# EasyEDA Pro project ProProject_诚君STC8H_2024-07-14.epro

# Schematic STC8H8K64U核心板
Create Date: 2024-06-16; Page Name: P1; Project Name: 诚君STC8H; Schematic Name: STC8H8K64U核心板; Update Date: 2024-07-07; Company: 诚君工作室; Drawed: HonestLiu; Page Size: A4; Reviewed: HonestLiu; Version: V1.2
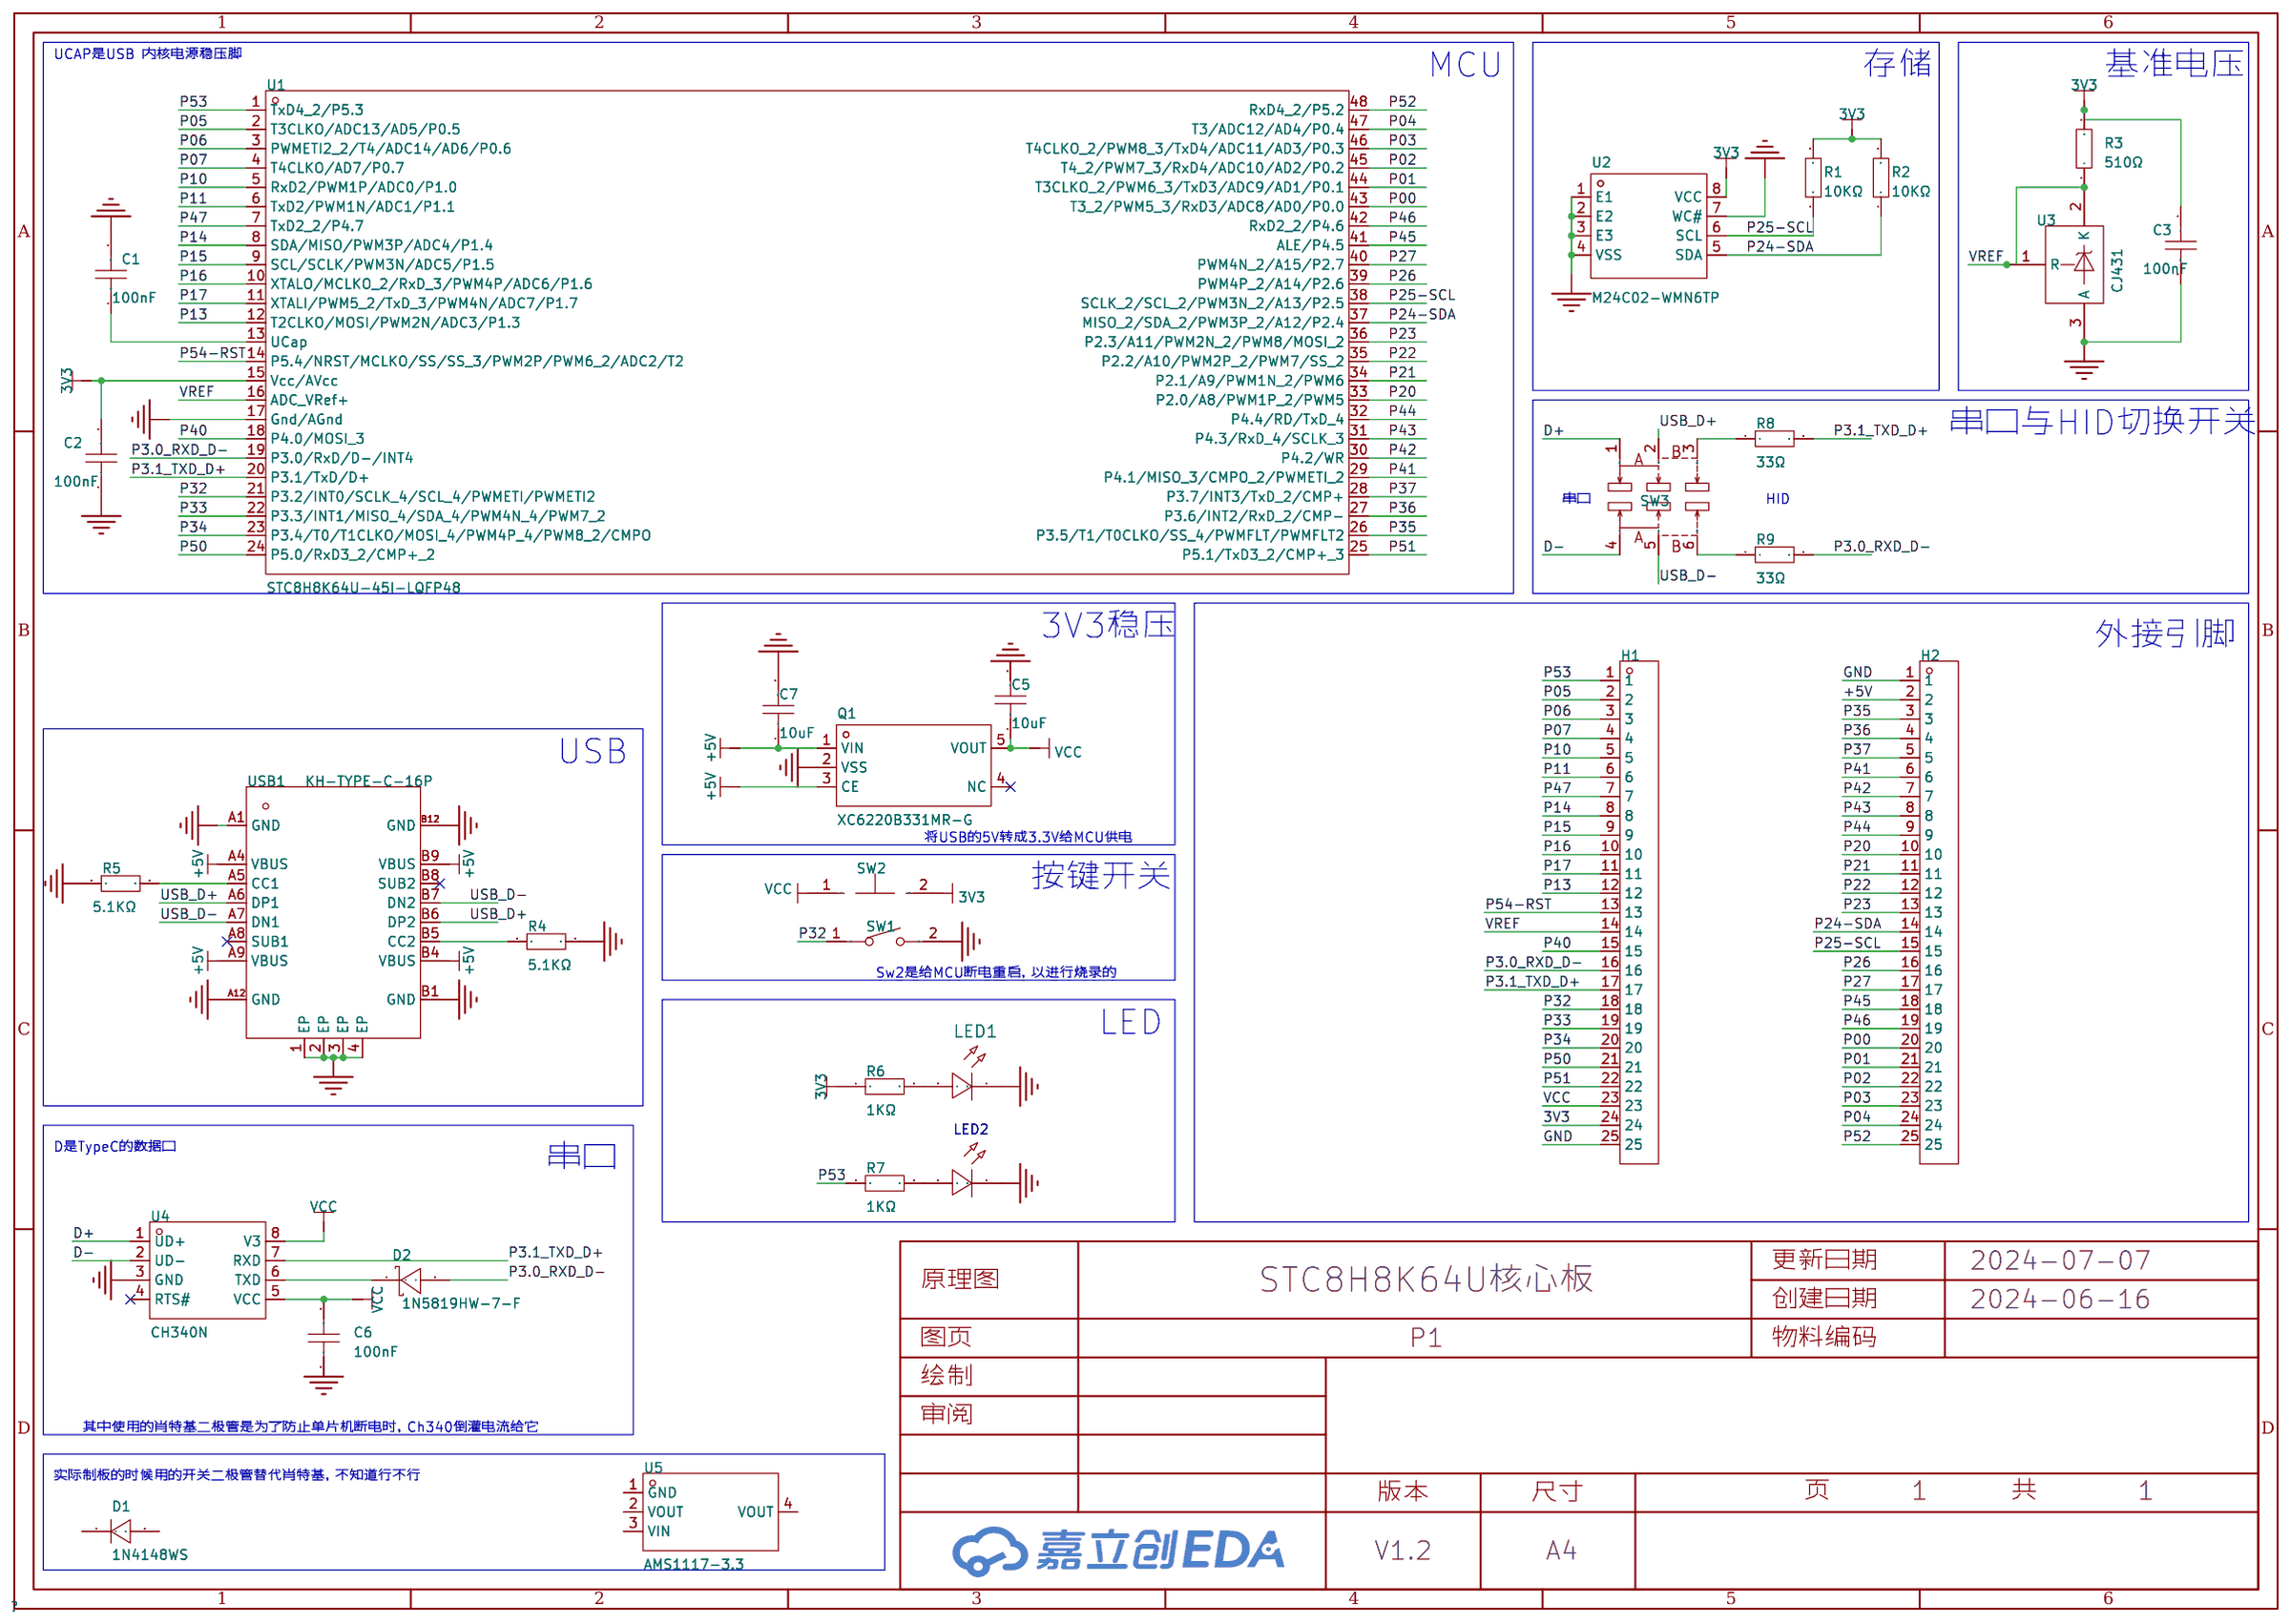
[diagram p0: schematic sheet]

## Parts
C1  100nF  [C0805]
C2  100nF  [C0805]
C3  100nF  [C0805]
C5  10uF  [C0805]
C6  100nF  [C0805]
C7  10uF  [C0805]
D1  1N4148WS  [SOD-323_L1.8-W1.3-LS2.5-RD]
D2  1N5819HW-7-F  [SOD-123_L2.7-W1.6-LS3.7-RD]
H1  X6511WV-25H-C60D30  [HDR-TH_25P-P2.54-V-M]
H2  X6511WV-25H-C60D30  [HDR-TH_25P-P2.54-V-M]
LED1  -  [LED_0805]
LED2  -  [LED_0805]
Q1  XC6220B331MR-G  [SOT-25_L3.0-W1.6-P0.95-LS2.8-TL]
R1  10KΩ  [R0805]
R2  10KΩ  [R0805]
R3  510Ω  [R0805]
R4  5.1KΩ  [R0805]
R5  5.1KΩ  [R0805]
R6  1KΩ  [R0805]
R7  1KΩ  [R0805]
R8  33Ω  [R0805]
R9  33Ω  [R0805]
SW1  TS-1088-AR02016  [SW-SMD_L3.9-W3.0-P4.45]
SW2  TS-1089A-B3D4  [KEY-SMD_2P-L6.0-W3.8-LS7.30-L]
SW3  MST22D18G2 125  [SW-SMD_MST22D18G2]
U1  STC8H8K64U-45I-LQFP48  [LQFP-48_L7.0-W7.0-P0.50-LS9.0-BL]
U2  M24C02-WMN6TP  [SOIC-8_L4.9-W3.9-P1.27-LS6.0-BL]
U3  CJ431  [SOT-23-3_L2.9-W1.6-P1.90-LS2.8-BR]
U4  CH340N  [SOP-8_L4.9-W3.9-P1.27-LS6.0-BL]
U5  AMS1117-3.3  [SOT-223-3_L6.5-W3.4-P2.30-LS7.0-BR]
USB1  KH-TYPE-C-16P  [USB-C-SMD_KH-TYPE-C-16P]

## Library data of the parts
C1-C3 C5-C7 = CAP_0805: Supplier Footprint: 0805
D1 = 1N4148WS_C2128: 二极管配置:独立式;正向压降(Vf):1.25V@150mA;直流反向耐压(Vr):100V;平均整流电流(Io):150mA;功率:200mW;反向恢复时间(trr):4ns;; LCSC Part Name: 电压:100V 电流:150mA; Supplier Part: C2128; Manufacturer: CJ(江苏长电/长晶); Supplier Footprint: SOD-323; JLCPCB Part Class: 基础库; Datasheet: https://atta.szlcsc.com/upload/public/pdf/source/20140809/1457707208178.pdf; Supplier: LCSC; Diode Configuration: 独立式; Forward Voltage (Vf@If): 1.25V@150mA; Reverse Voltage (Vr): 100V; Average Rectified Current (Io): 150mA; Power Dissipation: 200mW; Reverse Leakage Current: 1uA@75V; Reverse Recovery Time (trr): 4ns
D2 = 1N5819HW-7-F: 正向压降(Vf):450mV@1A;直流反向耐压(Vr):40V;平均整流电流(Io):1A;; LCSC Part Name: 电压:40V 电流:1A; Supplier Part: C82544; Manufacturer: DIODES(美台); Supplier Footprint: SOD-123; JLCPCB Part Class: 扩展库; Datasheet: https://atta.szlcsc.com/upload/public/pdf/source/20161024/1477288459223.pdf; Supplier: LCSC; Forward Voltage (Vf@If): 450mV@1A; Reverse Voltage (Vr): 40V; Average Rectified Current (Io): 1A; Reverse Leakage Current (Ir): 1mA@40V
H1 H2 = X6511WV-25H-C60D30: 插针结构:1x25P;间距:2.54mm;行距:2.54mm;圆针/方针:方针;安装类型:-;排数:单排;总PIN位数:25P;额定电流:3A;额定电压:250V;配合针长度:6mm;塑高:2.5mm;端接针长度:3mm;触头材质:黄铜;触头镀层:金;工作温度范围:-40℃~+105℃;焊接温度(最大值):260℃;颜色:黑色;; LCSC Part Name: 1x25P 间距:2.54mm 方针; Supplier Part: C725957; Manufacturer: XKB Connection(中国星坤); Supplier Footprint: 插件,P=2.54mm; JLCPCB Part Class: 扩展库; Supplier: LCSC; Pin Structure: 1x25P; Pitch: 2.54mm; Row Spacing: 2.54mm; Circluar Pins/Square Pins: 方针; Number of Rows: 单排; Number of Pins: 25P; Current Rating (Max): 3A; Voltage Rating (Max): 250V; Length of Mating Pin: 6mm; Insulation Height: 2.5mm; Length of End Connection Pin: 3mm; Contact Material: 黄铜; Contact Plating: 金; Operating Temperature Range: -40℃~+105℃; Soldering Temperature(Max): 260℃; Color: 黑色
LED1 = LED_0805-R: Supplier Footprint: 0805
LED2 = LED_0805-B: Supplier Footprint: 0805
Q1 = XC6220B331MR-G: 输出类型:固定;最大输入电压:6V;输出电压:3.3V;最大输出电流:1A;电源纹波抑制比(PSRR):50dB@(1kHz);输出极性:正极;; LCSC Part Name: 输入6V 输出3.3V 1A; Supplier Part: C86534; Manufacturer: TOREX(特瑞仕); Supplier Footprint: SOT-25-5; JLCPCB Part Class: 扩展库; Datasheet: https://atta.szlcsc.com/upload/public/pdf/source/20161119/1479540186106.pdf; Supplier: LCSC; Output Type: 固定; Maximum Input Voltage: 6V; Output Voltage: 3.3V; MAX Output Current: 1A; Power Supply Rejection Ratio (PSRR): 50dB@(1kHz); Dropout Voltage: 655mV@(1A); standby current: 18uA; Operating Temperature: -40℃~+85℃; Output Polarity: 正极; Number of Outputs: 1
R1-R9 = Res_0805: Supplier Footprint: 0805
SW1 = TS-1088-AR02016: 电路结构:单刀单掷;按钮形状:圆形按钮;作用力:160gf;安装方式:立贴;开关长度:4mm;开关宽度:3mm;开关高度:2mm;带支架:不带;触点电流:50mA;额定电压(DC):12V;绝缘电阻:100MΩ;机械寿命:10万次;; LCSC Part Name: 4*3*2mm 立贴 轻触开关; Supplier Part: C720477; Manufacturer: XUNPU(讯普); Supplier Footprint: SMD; JLCPCB Part Class: 扩展库; Datasheet: https://atta.szlcsc.com/upload/public/pdf/source/20200810/C720475_60D09DD6C54279ADDB2DC25100F1CC11.pdf; Supplier: LCSC; Circuit: 单刀单掷; Actuator Style: 圆形按钮; Operating Force: 160gf; Mounting Style: 立贴; Switch Length: 4mm; Switch Width: 3mm; Switch Height: 2mm; Strike Gundam: 不带; Contact Current: 50mA; Voltage Rating (DC): 12V; Insulation Resistance: 100MΩ; Actuator/Cap Color: 黑色; Pin Style: SMD接片; Mechanical Life: 10万次; Operating Temperature: -30℃~+80℃
SW2 = TS-1089A-B3D4: 电路结构:单刀单掷;按钮形状:圆形按钮;安装方式:-;开关长度:6mm;开关宽度:3.65mm;开关高度:2.6mm;带灯:-;机械寿命:-;; LCSC Part Name: 轻触开关6.0*3.65*2.6常闭式硅胶圆蓝柄250gf; Supplier Part: C498305; Manufacturer: Yuandi(元迪); Supplier Footprint: SMD,3.7x6mm; JLCPCB Part Class: 扩展库; Datasheet: https://atta.szlcsc.com/upload/public/pdf/source/20200318/C498305_E1D5433E42700991680A097C7C5FB391.pdf; Supplier: LCSC; Circuit: 单刀单掷; Actuator Style: 圆形按钮; Switch Length: 6mm; Switch Width: 3.65mm; Switch Height: 2.6mm
SW3 = MST22D18G2 125: 电路结构:双刀双掷;安装方式:立贴;开关颜色:黑色;额定电流(DC):100mA;额定电压(DC):12V;机械寿命:1万次;; LCSC Part Name: 拨动开关/两档立式 6脚贴片 柄长2.0mm 大六立贴 9.1*3.5mm; Supplier Part: C2906280; Manufacturer: SHOU HAN(首韩); Supplier Footprint: SMD; JLCPCB Part Class: 扩展库; Datasheet: https://atta.szlcsc.com/upload/public/pdf/source/20211019/449AD4EDF23AADA7A5C4E3C063EDBB30.pdf; Supplier: LCSC; Circuit: 双刀双掷; Pin Style: 鸥翼型; Mounting Style: 立贴; Actuator Color: 黑色; Current Rating (DC): 100mA; Voltage Rating (DC): 12V; Mechanical Life: 1万次; Operating Temperature: -25℃~+70℃
U1 = STC8H8K64U-45I-LQFP48: CPU内核:51系列;程序存储容量:64KB;GPIO端口数量:-;工作电压范围:-;CPU最大主频:-;程序存储器类型:FLASH;; LCSC Part Name: 宽电压/高速/高可靠/低功耗/强抗静电/较强抗干扰的新一代 8051 单片机; Supplier Part: C3013145; Manufacturer: STC(宏晶); Supplier Footprint: LQFP-48(7x7); JLCPCB Part Class: 扩展库; Datasheet: https://atta.szlcsc.com/upload/public/pdf/source/20230914/FE7F6A67FEB4E2D9A560A799C5B97078.pdf; Supplier: LCSC; CPU Core: 51系列; Program Storage Size: 64KB; Program Memory Type: FLASH
U2 = M24C02-WMN6TP: 接口类型:I2C;存储容量:2Kbit;; Supplier Part: C7562; Manufacturer: ST(意法半导体); Supplier Footprint: SOIC-8; JLCPCB Part Class: 扩展库; Datasheet: https://atta.szlcsc.com/upload/public/pdf/source/20140724/1457707167301.pdf; Supplier: LCSC; Interface Type: I2C; Memory Size: 2Kbit; Supply Voltage: 2.5V~5.5V; Operating Temperature: -40℃~+85℃
U3 = CJ431_C3113: 输出类型:可调;输出电压:2.5V~36V;输出电流:100mA;精度:±0.5%;; Supplier Part: C3113; Manufacturer: CJ(江苏长电/长晶); Supplier Footprint: SOT-23; JLCPCB Part Class: 基础库; Datasheet: https://atta.szlcsc.com/upload/public/pdf/source/20180130/C154948_15172973254591323355.pdf; Supplier: LCSC; Output Type: 可调; Output Voltage: 2.5V~36V; Output Current: 100mA; Tolerance: ±0.5%; Temperature Coefficient: 50ppm/℃; Minimum Cathode Current for Regulation: 1mA; Operating Temperature: -25℃~+85℃@(TA)
U4 = CH340N: LCSC Part Name: USB转串口芯片 CH340; Supplier Part: C2977777; Manufacturer: WCH(南京沁恒); Supplier Footprint: SOP-8; JLCPCB Part Class: 扩展库; Datasheet: https://atta.szlcsc.com/upload/public/pdf/source/20230530/6E401E9554E9F5311886CC8B3F89B62E.pdf; Supplier: LCSC
U5 = AMS1117-3.3_C6186: 输出类型:固定;最大输入电压:-;输出电压:3.3V;最大输出电流:1A;电源纹波抑制比(PSRR):72dB@(120Hz);输出极性:正极;; LCSC Part Name: 输出3.3V 1A; Supplier Part: C6186; Manufacturer: AMS; Supplier Footprint: SOT-223; JLCPCB Part Class: 基础库; Datasheet: https://atta.szlcsc.com/upload/public/pdf/source/20180727/C6186_7A095716F0823C02F1997A905E26C086.pdf; Supplier: LCSC; Output Type: 固定; Output Voltage: 3.3V; MAX Output Current: 1A; Power Supply Rejection Ratio (PSRR): 72dB@(120Hz); Dropout Voltage: 1.3V@(800mA); Output Polarity: 正极; Number of Outputs: 1
USB1 = KH-TYPE-C-16P: 连接器类型:Type-C;标准:-;公母:母;端口数量:1;触点数量:16P;安装方式:卧贴;额定电流 - 电源:3A;工作温度范围:-40℃~+85℃;; LCSC Part Name: Type-C 母 卧贴; Supplier Part: C709357; Manufacturer: kinghelm(金航标); Supplier Footprint: SMD; JLCPCB Part Class: 扩展库; Datasheet: https://atta.szlcsc.com/upload/public/pdf/source/20200911/C709357_AA8DCEB38BB20E3035A7ED7AE7667837.pdf; Supplier: LCSC; Connector Type: Type-C; Gender: 母; Number of Ports: 1; Number of Contacts: 16P; Mounting Style: 卧贴; Current Rating - Power (Max): 3A; Operating Temperature Range: -40℃~+85℃

## Nets
3V3: C2.2 C3.1 H1.24 R1.2 R2.2 R3.2 R6.1 SW2.2 U1.15(Vcc/AVcc) U2.8(VCC)
+5V: C7.1 H2.2 Q1.1(VIN) Q1.3(CE) USB1.A4(VBUS) USB1.A9(VBUS) USB1.B4(VBUS) USB1.B9(VBUS)
GND: C1.2 C2.1 C3.2 C5.2 C6.1 C7.2 H1.25 H2.1 LED1.1(C) LED2.1(C) Q1.2(VSS) R4.2 R5.1 SW1.2 U1.17(Gnd/AGnd) U2.1(E1) U2.2(E2) U2.3(E3) U2.4(VSS) U2.7(WC#) U3.3(A) U4.3(GND) USB1.1(EP) USB1.2(EP) USB1.3(EP) USB1.4(EP) USB1.A1(GND) USB1.A12(GND) USB1.B1(GND) USB1.B12(GND)
VCC: C5.1 C6.2 H1.23 Q1.5(VOUT) SW2.1 U4.5(VCC) U4.8(V3)
D+: SW3.1 U4.1(UD+)
D-: SW3.4 U4.2(UD-)
P00: H2.20 U1.43(T3_2/PWM5_3/RxD3/ADC8/AD0/P0.0)
P01: H2.21 U1.44(T3CLKO_2/PWM6_3/TxD3/ADC9/AD1/P0.1)
P02: H2.22 U1.45(T4_2/PWM7_3/RxD4/ADC10/AD2/P0.2)
P03: H2.23 U1.46(T4CLKO_2/PWM8_3/TxD4/ADC11/AD3/P0.3)
P3.0_RXD_D-: D2.2(A) H1.16 R9.2 U1.19(P3.0/RxD/D-/INT4)
P3.1_TXD_D+: H1.17 R8.2 U1.20(P3.1/TxD/D+) U4.7(RXD)
P04: H2.24 U1.47(T3/ADC12/AD4/P0.4)
P05: H1.2 U1.2(T3CLKO/ADC13/AD5/P0.5)
P06: H1.3 U1.3(PWMETI2_2/T4/ADC14/AD6/P0.6)
P07: H1.4 U1.4(T4CLKO/AD7/P0.7)
P10: H1.5 U1.5(RxD2/PWM1P/ADC0/P1.0)
P11: H1.6 U1.6(TxD2/PWM1N/ADC1/P1.1)
P13: H1.12 U1.12(T2CLKO/MOSI/PWM2N/ADC3/P1.3)
P14: H1.8 U1.8(SDA/MISO/PWM3P/ADC4/P1.4)
P15: H1.9 U1.9(SCL/SCLK/PWM3N/ADC5/P1.5)
P16: H1.10 U1.10(XTALO/MCLKO_2/RxD_3/PWM4P/ADC6/P1.6)
P17: H1.11 U1.11(XTALI/PWM5_2/TxD_3/PWM4N/ADC7/P1.7)
P20: H2.10 U1.33(P2.0/A8/PWM1P_2/PWM5)
P21: H2.11 U1.34(P2.1/A9/PWM1N_2/PWM6)
P22: H2.12 U1.35(P2.2/A10/PWM2P_2/PWM7/SS_2)
P23: H2.13 U1.36(P2.3/A11/PWM2N_2/PWM8/MOSI_2)
P24-SDA: H2.14 R2.1 U1.37(MISO_2/SDA_2/PWM3P_2/A12/P2.4) U2.5(SDA)
P25-SCL: H2.15 R1.1 U1.38(SCLK_2/SCL_2/PWM3N_2/A13/P2.5) U2.6(SCL)
P26: H2.16 U1.39(PWM4P_2/A14/P2.6)
P27: H2.17 U1.40(PWM4N_2/A15/P2.7)
P32: H1.18 SW1.1 U1.21(P3.2/INT0/SCLK_4/SCL_4/PWMETI/PWMETI2)
P33: H1.19 U1.22(P3.3/INT1/MISO_4/SDA_4/PWM4N_4/PWM7_2)
P34: H1.20 U1.23(P3.4/T0/T1CLKO/MOSI_4/PWM4P_4/PWM8_2/CMPO)
P35: H2.3 U1.26(P3.5/T1/T0CLKO/SS_4/PWMFLT/PWMFLT2)
P36: H2.4 U1.27(P3.6/INT2/RxD_2/CMP-)
P37: H2.5 U1.28(P3.7/INT3/TxD_2/CMP+)
P40: H1.15 U1.18(P4.0/MOSI_3)
P41: H2.6 U1.29(P4.1/MISO_3/CMPO_2/PWMETI_2)
P42: H2.7 U1.30(P4.2/WR)
P43: H2.8 U1.31(P4.3/RxD_4/SCLK_3)
P44: H2.9 U1.32(P4.4/RD/TxD_4)
P45: H2.18 U1.41(ALE/P4.5)
P46: H2.19 U1.42(RxD2_2/P4.6)
P47: H1.7 U1.7(TxD2_2/P4.7)
P50: H1.21 U1.24(P5.0/RxD3_2/CMP+_2)
P51: H1.22 U1.25(P5.1/TxD3_2/CMP+_3)
P52: H2.25 U1.48(RxD4_2/P5.2)
P53: H1.1 R7.1 U1.1(TxD4_2/P5.3)
P54-RST: H1.13 U1.14(P5.4/NRST/MCLKO/SS/SS_3/PWM2P/PWM6_2/ADC2/T2)
USB_D+: SW3.2 USB1.A6(DP1) USB1.B6(DP2)
USB_D-: SW3.5 USB1.A7(DN1) USB1.B7(DN2)
VREF: H1.14 R3.1 U1.16(ADC_VRef+) U3.1(R) U3.2(K)
$1N661: C1.1 U1.13(UCap)
$1N2230: R4.1 USB1.B5(CC2)
$1N2337: R5.2 USB1.A5(CC1)
$1N3155: D2.1(K) U4.6(TXD)
$1N4416: R8.1 SW3.3
$1N4419: R9.1 SW3.6
Net-(LED1-2): LED1.2(A) R6.2
Net-(LED2-2): LED2.2(A) R7.2

Not connected (* = marked no-connect by the designer): D1 1(K) 2(A); Q1 4(NC)*; U4 4(RTS#)*; U5 1(GND) 2(VOUT) 3(VIN) 4(VOUT); USB1 A8(SUB1)* B8(SUB2)*

## Notes on the sheet
- UCAP是USB 内核电源稳压脚
- MCU
- 存储
- 基准电压
- 串口与HID切换开关
- 串口
- HID
- 3V3稳压
- 外接引脚
- USB
- 将USB的5V转成3.3V给MCU供电
- 按键开关
- Sw2是给MCU断电重启，以进行烧录的
- LED
- D是TypeC的数据口
- 串口
- 其中使用的肖特基二极管是为了防止单片机断电时，Ch340倒灌电流给它
- 实际制板的时候用的开关二极管替代肖特基，不知道行不行

# Board PCB1
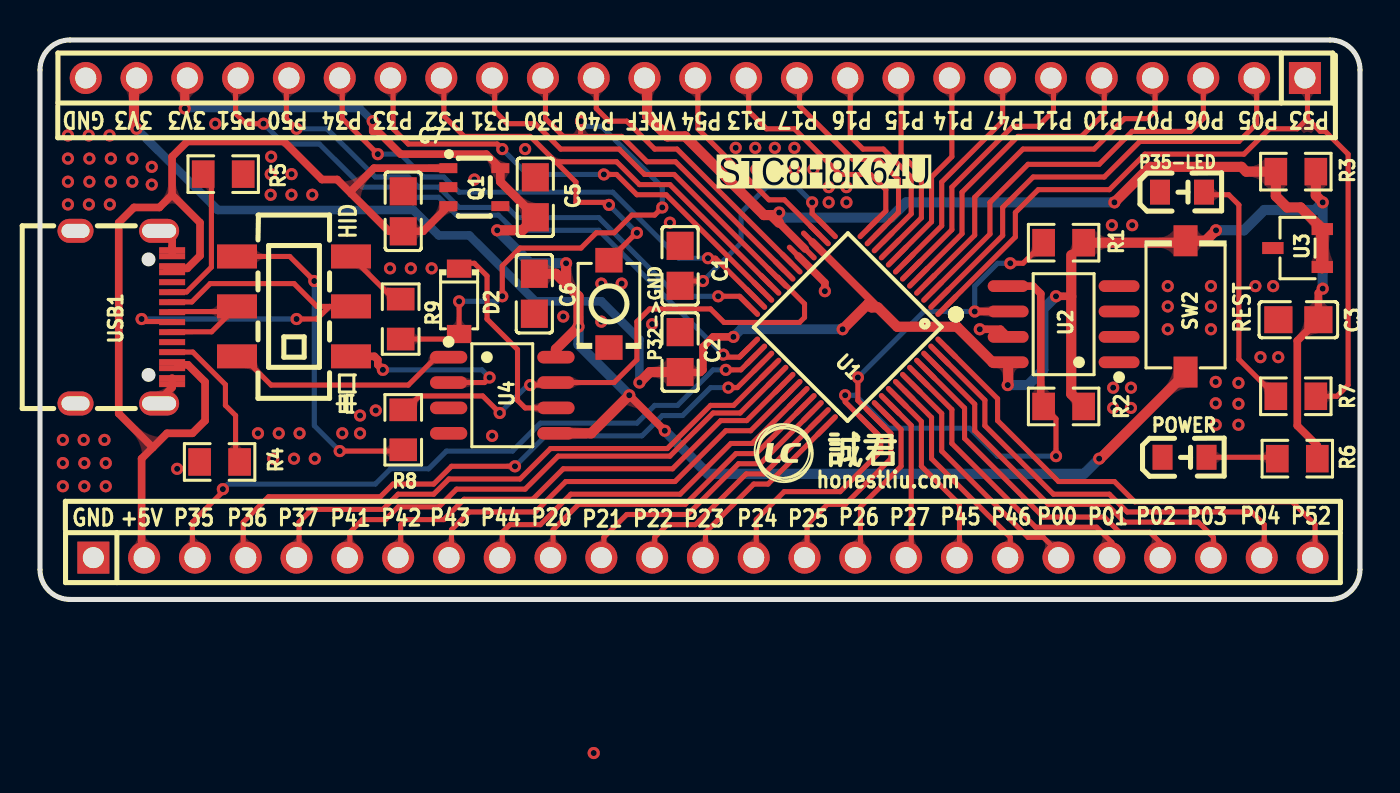
[diagram p1: board, top side]
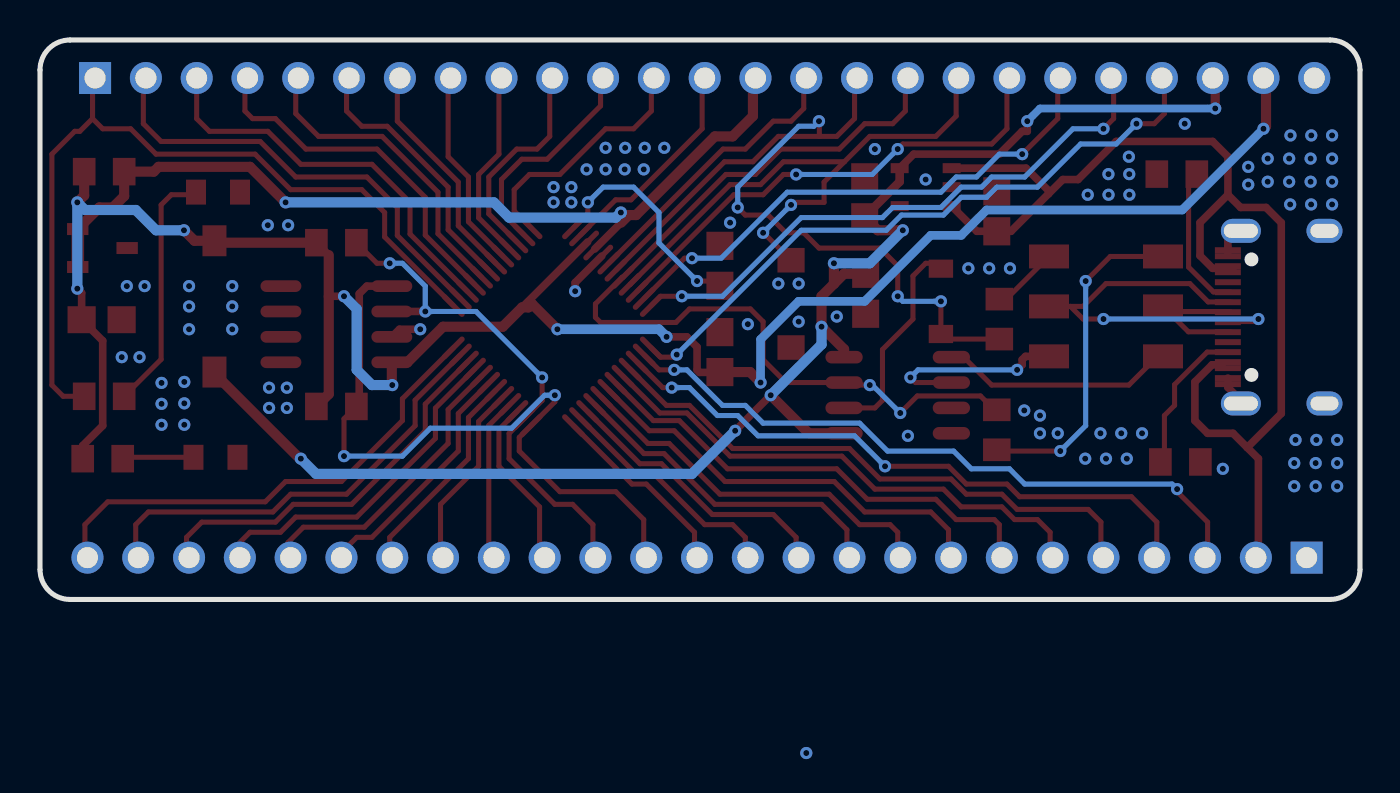
[diagram p2: board, bottom side, seen from below]

Outline 66 x 28 mm; copper layers: Top Layer, Bottom Layer. Coordinates in mm from the lower left corner of the outline.
Outline path: 0,26.5 0,1.5 arc(0.44,0.44) 1.5,0 64.5,0 arc(65.56,0.44) 66,1.5 66,26.5 arc(65.56,27.56) 64.5,28 1.5,28 arc(0.44,27.56) 0,26.5
Stack: Top Layer 0.035mm / Dielectric1 1.51mm FR4 er 4.5 / Bottom Layer 0.035mm

## Design rules (mm)
template: JLCPCB Capability(Two Layers Board)
spacing copperThickness1oz (default): track to track 0.102, other pairs 0.152 to 0.3
spacing copperThickness2oz: track to track 0.203, other pairs 0.152 to 0.3
track width copperThickness1oz (default): min 0.127, default 0.254, max 2.54
track width copperThickness2oz: min 0.203, default 0.254, max 2.54
differential pair differentialPair (default): width min 0.127, default 0.254, max 2.54; gap min 0.152, default 0.152
via viaSize (default): diameter min 0.5, default 0.61, max 10; hole min 0.3, default 0.305, max 6.3

## Placement (name value [footprint] x y rotation side)
C1  100nF  [C0805]  32 16.7 90 top
C2  100nF  [C0805]  32 12.38 270 top
C3  100nF  [C0805]  62.92 14 180 top
C5  10uF  [C0805]  24.77 20.13 90 top
C6  100nF  [C0805]  24.72 15.3 90 top
C7  10uF  [C0805]  18.16 19.42 90 top
D2  1N5819HW-7-F  [SOD-123_L2.7-W1.6-LS3.7-RD]  20.95 14.92 270 top
H1  X6511WV-25H-C60D30  [HDR-TH_25P-P2.54-V-M]  32.77 26.09 180 top
H2  X6511WV-25H-C60D30  [HDR-TH_25P-P2.54-V-M]  33.15 2.09 0 top
P32->GND  TS-1088-AR02016  [SW-SMD_L3.9-W3.0-P4.45]  28.45 14.79 270 top
P35-LED  -  [LED_0805]  57.15 20.38 0 top
POWER  -  [LED_0805]  57.28 7.11 0 top
Q1  XC6220B331MR-G  [SOT-25_L3.0-W1.6-P0.95-LS2.8-TL]  21.72 20.63 0 top
R1  10KΩ  [R0805]  51.18 17.85 0 top
R2  10KΩ  [R0805]  51.18 9.66 0 top
R3  510Ω  [R0805]  62.79 21.41 0 top
R4  5.1KΩ  [R0805]  8.98 6.88 180 top
R5  5.1KΩ  [R0805]  9.16 21.28 180 top
R6  1KΩ  [R0805]  62.86 7.05 180 top
R7  1KΩ  [R0805]  62.79 10.17 180 top
R8  33Ω  [R0805]  18.16 8.49 90 top
R9  33Ω  [R0805]  18.03 14.03 270 top
SW2  TS-1089A-B3D4  [KEY-SMD_2P-L6.0-W3.8-LS7.30-L]  57.28 14.66 270 top
SW3  MST22D18G2 125  [SW-SMD_MST22D18G2]  12.7 14.66 90 top
U1  STC8H8K64U-45I-LQFP48  [LQFP-48_L7.0-W7.0-P0.50-LS9.0-BL]  40.39 13.65 135 top
U2  M24C02-WMN6TP  [SOIC-8_L4.9-W3.9-P1.27-LS6.0-BL]  51.18 13.78 90 top
U3  CJ431  [SOT-23-3_L2.9-W1.6-P1.90-LS2.8-BR]  62.88 17.59 0 top
U4  CH340N  [SOP-8_L4.9-W3.9-P1.27-LS6.0-BL]  23.11 10.22 270 top
USB1  KH-TYPE-C-16P  [USB-C-SMD_KH-TYPE-C-16P]  4.19 14.13 270 top

## Footprints (pads in the part's own frame, mm; a bottom-side part is the same pattern mirrored in y, then rotated)
C0805
  rect 1.41x1.35 smd: 1(-1,0) 2(1,0)
HDR-TH_25P-P2.54-V-M
  rect 1.6x1.6 hole 1.05: 1(-30.48,0)
  round 1.6 hole 1.05: 2(-27.94,0) 3(-25.4,0) 4(-22.86,0) 5(-20.32,0) 6(-17.78,0) 7(-15.24,0) 8(-12.7,0) 9(-10.16,0) 10(-7.62,0) 11(-5.08,0) 12(-2.54,0) 13(0,0) 14(2.54,0) 15(5.08,0) 16(7.62,0) 17(10.16,0) 18(12.7,0) 19(15.24,0) 20(17.78,0) 21(20.32,0) 22(22.86,0) 23(25.4,0) 24(27.94,0) 25(30.48,0)
KEY-SMD_2P-L6.0-W3.8-LS7.30-L
  rect 1.55x1.2 smd: 1(3.285,0) 2(-3.285,0)
LED_0805
  rect 1x1.25 smd: 1(-1.15,0.005) 2(1.05,0.005)
LQFP-48_L7.0-W7.0-P0.50-LS9.0-BL
  oval 0.27x1.5 smd: 1(-2.75,-4.25) 2(-2.25,-4.25) 3(-1.75,-4.25) 4(-1.25,-4.25) 5(-0.75,-4.25) 6(-0.25,-4.25) 7(0.25,-4.25) 8(0.75,-4.25) 9(1.25,-4.25) 10(1.75,-4.25) 11(2.25,-4.25) 12(2.75,-4.25) 25(2.75,4.25) 26(2.25,4.25) 27(1.75,4.25) 28(1.25,4.25) 29(0.75,4.25) 30(0.25,4.25) 31(-0.25,4.25) 32(-0.75,4.25) 33(-1.25,4.25) 34(-1.75,4.25) 35(-2.25,4.25) 36(-2.75,4.25)
  oval 1.5x0.27 smd: 13(4.25,-2.75) 14(4.25,-2.25) 15(4.25,-1.75) 16(4.25,-1.25) 17(4.25,-0.75) 18(4.25,-0.25) 19(4.25,0.25) 20(4.25,0.75) 21(4.25,1.25) 22(4.25,1.75) 23(4.25,2.25) 24(4.25,2.75) 37(-4.25,2.75) 38(-4.25,2.25) 39(-4.25,1.75) 40(-4.25,1.25) 41(-4.25,0.75) 42(-4.25,0.25) 43(-4.25,-0.25) 44(-4.25,-0.75) 45(-4.25,-1.25) 46(-4.25,-1.75) 47(-4.25,-2.25) 48(-4.25,-2.75)
R0805
  rect 1.133x1.377 smd: 1(-1,0) 2(1,0)
SOD-123_L2.7-W1.6-LS3.7-RD
  rect 0.91x1.22 smd: 1(-1.635,0) 2(1.635,0)
SOIC-8_L4.9-W3.9-P1.27-LS6.0-BL
  oval 0.588x2.045 smd: 1(-1.905,-2.772) 2(-0.635,-2.772) 3(0.635,-2.772) 4(1.905,-2.772) 5(1.905,2.772) 6(0.635,2.772) 7(-0.635,2.772) 8(-1.905,2.772)
SOP-8_L4.9-W3.9-P1.27-LS6.0-BL
  oval 0.63x1.865 smd: 1(-1.905,-2.683) 2(-0.635,-2.683) 3(0.635,-2.683) 4(1.905,-2.683) 5(1.905,2.683) 6(0.635,2.683) 7(-0.635,2.683) 8(-1.905,2.683)
SOT-23-3_L2.9-W1.6-P1.90-LS2.8-BR
  rect 1.07x0.6 smd: 1(1.235,-0.95) 2(1.235,0.95) 3(-1.235,0)
SOT-25_L3.0-W1.6-P0.95-LS2.8-TL
  rect 0.9x0.5 smd: 1(-1.3,0.95) 2(-1.3,0) 3(-1.3,-0.95) 4(1.3,-0.95) 5(1.3,0.95)
SW-SMD_L3.9-W3.0-P4.45
  rect 1.23x1.36 smd: 1(-2.185,0) 2(2.185,0)
SW-SMD_MST22D18G2
  rect 1.2x2 smd: 1(-2.5,2.85) 2(0,2.85) 3(2.5,2.85) 4(-2.5,-2.85) 5(0,-2.85) 6(2.5,-2.85)
USB-C-SMD_KH-TYPE-C-16P
  oval 1.2x2 hole 0.7x1.7: 1(-4.32,1.765) 2(4.32,1.765)
  oval 1.2x1.8 hole 0.7x1.4: 3(-4.32,-2.415) 4(4.32,-2.415)
  rect 0.3x1.3 smd: A1(-3.35,2.415) A4(-2.55,2.415) A5(-1.25,2.415) A6(-0.25,2.415) A7(0.25,2.415) A8(1.25,2.415) A9(2.55,2.415) A12(3.35,2.415) B1(3.05,2.415) B4(2.25,2.415) B5(1.75,2.415) B6(0.75,2.415) B7(-0.75,2.415) B8(-1.75,2.415) B9(-2.25,2.415) B12(-3.05,2.415)

## Nets
As in the schematic, except:
GND: C1.2 C2.1 C3.2 C5.2 C6.1 C7.2 H1.25 H2.1 P32->GND.2 P35-LED.1 POWER.1 Q1.2 R4.2 R5.1 U1.17 U2.1 U2.2 U2.3 U2.4 U2.7 U3.3 U4.3 USB1.1 USB1.2 USB1.3 USB1.4 USB1.A1 USB1.A12 USB1.B1 USB1.B12
P32: H1.18 P32->GND.1 U1.21
$1N3377: POWER.2 R6.2
$1N3427: P35-LED.2 R7.2

Pads without a net: Q1 4; U4 4; USB1 A8 B8

## Via types
v1: diameter 0.61, hole 0.305, Top Layer to Bottom Layer, 144 vias

## Routing (per net, layer and track width the routed paths; a pad name or vN(x,y) marks a point on that pad's centre or on a via; arc(x,y) is an arc through that point)
3V3: length 105.6
  Top Layer w0.381: 51.56,15.16 51.55,15.17 v1(50.8,15.17) ; v1(34.67,13.14) 33.66,13.14 33.15,12.63 33.15,11.49 33.02,11.36 32.02,11.36 C2.2 ; v1(64.14,15.55) 63.92,15.34 C3.1 62.86,12.95 62.86,8.7 63.86,7.7 R6.1 ; U1.15 41.89,14.62 ; R1.2 51.56,17.23
  Top Layer w0.508: 51.56,17.23 51.56,10.28 R2.2 ; v1(58.8,18.47) 58.28,17.95 SW2.2 57.18,17.85 R1.2 ; R3.2 63.79,20.22 v1(64.14,19.87) ; 4.7,25.97 4.7,23.68 v1(4.83,23.55) ; v1(48.39,10.73) 48.41,10.75 U2.8 47.63,11.87 45.85,13.65 42.86,13.65 41.89,14.62 41.58,14.62 41.4,14.79 v1(40.13,13.52) ; v1(29.97,10.85) 30.5,11.38 C2.2
  Bottom Layer w0.432: v1(4.83,23.55) 8.89,19.49 18.67,19.49 19.94,18.22 21.46,18.22 24.77,14.92 28.07,14.92 29.97,13.01 v1(29.97,10.85)
  Bottom Layer w0.482: v1(40.13,13.52) 35.05,13.52 v1(34.67,13.14)
  Bottom Layer w0.508: v1(48.39,10.73) 49.4,10.73 50.17,11.49 50.17,14.54 v1(50.8,15.17) ; v1(58.8,18.47) 60.2,18.47 61.21,19.49 63.75,19.49 v1(64.14,19.87) v1(64.14,15.55)
+5V: length 57.1
  Top Layer w0.381: 6.9,11.74 7.4,11.74 8.26,10.88 8.26,8.95 7.62,8.31 6.35,8.31 5.64,7.6 ; 5.64,7.6 3.94,9.3 3.94,18.86 4.7,19.62 5.97,19.62 6.6,20.25 ; 5.64,7.6 5.08,7.05 5.08,2.22 ; 15.57,20.3 17.45,18.42 C7.1 19.16,18.42 Q1.3 ; 15.57,20.3 15.57,20.46 16.7,21.58 20.42,21.58 ; 15.57,20.3 14.86,21.02 14.1,21.02 12.19,22.92 7.37,22.92 6.6,22.16 6.6,20.25 ; 6.6,20.25 8,18.86 8,17.2 7.37,16.57 6.34,16.57
GND: length 6.8
  Top Layer w0.381: 5.96,18.6 6.61,17.95 6.61,17.33 ; v1(39.24,15.43) 39.24,15.85 U1.17 ; USB1.B1 USB1.A12 6.61,10.61 5.96,9.96 ; v1(46.99,13.52) 48.03,13.52 U2.7
  vias: v1(1.14,7.98) v1(1.14,6.82) v1(1.14,5.66) v1(1.4,23.22) v1(1.4,22.06) v1(1.4,20.91) v1(1.4,19.77) v1(2.18,7.98) v1(2.22,6.82) v1(2.22,5.66) v1(2.44,23.22) v1(2.47,22.06) v1(2.47,20.91) v1(2.45,19.77) v1(3.22,7.98) v1(3.29,6.82) v1(3.29,5.66) v1(3.48,23.22) v1(3.49,19.77) v1(3.54,22.06) v1(3.54,20.91) v1(4.62,22.06) v1(4.62,20.91) v1(5.59,21.65) v1(5.59,20.76) v1(6.86,6.54) v1(8.76,23.81) v1(10.9,8.31) v1(11.56,22.16) v1(11.54,21.28) v1(11.53,20.25) v1(11.66,7.05) v1(11.94,8.31) v1(12.58,21.28) v1(12.57,20.25) v1(12.7,7.05) v1(12.98,8.31) v1(13.61,20.25) v1(13.74,7.05) v1(15.11,8.31) v1(16,9.2) v1(16,8.31) v1(16.79,9.46) v1(17.5,16.57) v1(18.54,16.57) v1(19.58,16.57) v1(21.72,21.02) v1(22.61,8.19) v1(24.26,22.54) v1(26.16,14.16) v1(28.07,15.81) v1(28.07,13.9) v1(29.08,15.81) v1(30.61,13.78) v1(31.5,18.86) v1(34.79,22.6) v1(35.76,22.6) v1(35.81,21.52) v1(36.74,22.6) v1(36.77,21.52) v1(37.72,22.6) v1(37.72,21.52) v1(38.67,21.52) v1(39.43,20.63) v1(39.43,19.87) v1(40.32,20.63) v1(40.32,19.87) v1(53.59,18.73) v1(53.66,10.6) v1(53.66,9.58) v1(54.61,18.73) v1(54.55,10.6) v1(54.55,9.58) v1(56.39,15.68) v1(56.39,14.66) v1(56.39,13.52) v1(58.55,15.68) v1(58.55,14.66) v1(58.55,13.52) v1(58.79,10.89) v1(58.79,9.81) v1(58.79,8.74) v1(59.92,10.84) v1(59.92,9.79) v1(59.92,8.74) v1(60.77,15.68) v1(61.02,12.12) v1(61.66,15.68) v1(61.91,12.12)
VCC: length 75.9
  Top Layer w0.381: 23.02,21.58 22.32,22.28 18.03,22.28 16.89,23.43 16.64,23.43 v1(16.64,23.94) ; v1(31.24,8.44) v1(29.46,10.22)
  Top Layer w0.432: C5.1 24.77,19.16 23.02,20.9 23.02,21.58
  Top Layer w0.457: 7.24,25.97 v1(7.24,24.57)
  Top Layer w0.508: 26.3,15.79 v1(26.3,16.82) ; 26.3,15.79 25.8,16.3 C6.2 ; 26.3,15.79 26.92,15.17 v1(26.92,13.65) 25.8,12.52 U4.8 ; U4.5 27.56,8.31 v1(29.46,10.22) ; SW2.1 57.28,11.31 53.01,7.05 v1(52.96,7.05) ; v1(22.86,18.47) 24.11,18.47 C5.1
  Bottom Layer w0.381: v1(16.64,23.94) 16,24.57 v1(7.24,24.57)
  Bottom Layer w0.508: v1(52.96,7.05) 52.2,6.28 33.4,6.28 v1(31.24,8.44) ; v1(29.46,10.22) 26.92,12.76 v1(26.92,13.65) ; v1(22.86,18.47) 24.51,16.82 v1(26.3,16.82)
(no net):
  vias: v1(27.69,-7.69)
D+: length 11.8
  Top Layer w0.254: U4.1 19.81,12.12 18.42,10.73 11.56,10.73 10.12,12.16 SW3.1
D-: length 9.7
  Top Layer w0.254: v1(22.48,11.11) 22.23,10.85 U4.2
  Top Layer w0.381: SW3.4 16.72,12.16 16.89,12 16.89,11.74 v1(17.14,11.49)
  Bottom Layer w0.254: v1(17.14,11.49) 22.1,11.49 v1(22.48,11.11)
P00: length 12.3
  Top Layer w0.254: 43.57,10.82 45.08,9.3 45.08,7.43 49.4,3.11 50.17,3.11 51.05,2.22 51.05,2.09
P01: length 14.9
  Top Layer w0.254: 53.59,2.09 53.59,2.85 52.83,3.62 49.78,3.62 45.59,7.81 45.59,9.5 U1.44
P02: length 17
  Top Layer w0.254: U1.45 46.23,9.57 46.23,8.06 50.17,4.12 53.21,4.12 53.98,3.36 55.5,3.36 56.13,2.73 56.13,2.09
P03: length 19.5
  Top Layer w0.254: 58.67,2.09 58.67,3.11 57.91,3.87 54.23,3.87 53.34,4.76 50.42,4.76 46.74,8.44 46.74,9.77 U1.46
P3.0_RXD_D-: length 41.9
  Top Layer w0.254: 27.03,23.17 26.16,23.17 25.27,24.06 25.27,25.97 ; 27.03,23.17 29.08,23.17 30.35,21.9 31.78,21.9 U1.19 ; 27.03,23.17 27.03,23.92 v1(27.05,23.94) ; v1(31.11,19.62) 30.73,19.24 29.59,19.24 28.7,18.35 27.81,18.35 27.05,17.59 24,17.59 23.11,16.7 v1(23.11,15.17) ; v1(20.95,14.92) D2.2 20.7,13.03 R9.2
  Bottom Layer w0.254: v1(31.11,19.62) 31.11,20.63 28.07,23.68 27.3,23.68 v1(27.05,23.94) ; v1(20.95,14.92) 22.86,14.92 v1(23.11,15.17)
P3.1_TXD_D+: length 46.1
  Top Layer w0.254: v1(24.51,10.73) 25.67,10.73 U4.7 28.7,10.85 29.85,12 29.85,13.9 30.48,14.54 33.53,14.54 34.21,13.86 37.97,13.86 38.23,14.11 38.23,14.79 36.89,16.12 U1.20 31.71,21.27 30.23,21.27 28.96,22.54 26.04,22.54 24.77,23.81 23.37,23.81 22.73,24.44 22.73,25.97 ; R8.2 18.28,9.49 18.98,10.18 22.14,10.18 v1(22.99,9.33)
  Bottom Layer w0.254: v1(24.51,10.73) 24.38,10.73 v1(22.99,9.33)
P04: length 22.1
  Top Layer w0.254: 44.98,12.23 47.24,9.97 47.24,8.7 50.67,5.27 53.47,5.27 54.36,4.38 60.58,4.38 61.21,3.74 61.21,2.09
P05: length 22.5
  Top Layer w0.254: 60.83,25.97 60.83,23.81 59.94,22.92 54.99,22.92 53.21,21.14 49.66,21.14 48.13,19.62 48.13,18.21 44.98,15.06
P06: length 20
  Top Layer w0.254: 58.29,25.97 58.17,25.84 58.17,24.06 57.53,23.43 54.61,23.43 52.96,21.78 49.4,21.78 47.5,19.87 47.5,18.29 U1.3
P07: length 17.7
  Top Layer w0.254: U1.4 46.74,18.23 46.74,20.13 49.15,22.54 52.7,22.54 54.23,24.06 55.37,24.06 55.75,24.44 55.75,25.97
P10: length 15.6
  Top Layer w0.254: U1.5 46.1,18.3 46.1,20.38 48.89,23.17 52.07,23.17 53.21,24.32 53.21,25.97
P11: length 13.2
  Top Layer w0.254: 43.57,16.48 45.59,18.5 45.59,20.63 48.64,23.68 49.91,23.68 50.67,24.44 50.67,25.97
P13: length 12.3
  Top Layer w0.254: U1.12 42.29,19.44 42.29,20.51 41.53,21.27 40.01,21.27 37.72,23.55 36.32,23.55 35.43,24.44 35.43,25.97
P14: length 9.9
  Top Layer w0.254: U1.8 44.58,18.9 44.58,21.14 45.59,22.16 45.59,25.97
P15: length 9.5
  Top Layer w0.254: 43.05,25.97 43.05,22.28 44.07,21.27 44.07,19.1 U1.9
P16: length 10.5
  Top Layer w0.254: U1.10 43.56,19.3 43.56,21.14 42.16,22.54 41.15,22.54 40.51,23.17 40.51,25.97
P17: length 11
  Top Layer w0.254: U1.11 42.93,19.37 42.93,21.02 41.91,22.03 40.64,22.03 37.97,24.7 37.97,25.97
P20: length 16.6
  Top Layer w0.254: 25.65,2.09 25.65,3.49 26.92,4.76 32.26,4.76 34.8,7.3 35.8,7.3 U1.33
P21: length 14
  Top Layer w0.254: 28.19,2.09 28.19,3.11 29.34,4.25 32.39,4.25 34.92,6.79 36,6.79 U1.34
P22: length 11.7
  Top Layer w0.254: 38.97,9.05 36.2,6.28 35.31,6.28 32.77,3.74 31.37,3.74 30.73,3.11 30.73,2.09
P23: length 9.5
  Top Layer w0.254: 33.27,2.09 33.27,3.36 35.69,5.77 36.4,5.77 U1.36
P24-SDA: length 35.1
  Top Layer w0.254: v1(40.26,10.22) 40.26,9.89 U1.37 42.04,8.11 42.04,7.43 40.01,5.39 37.21,5.39 35.81,4 35.81,2.09 ; v1(50.8,7.17) 50.8,9.04 R2.1
  Top Layer w0.381: R2.1 50.04,9.8 50.04,15.3 49.66,15.68 U2.5
  Bottom Layer w0.254: v1(40.26,10.22) 40.77,10.22 42.42,8.57 46.48,8.57 47.88,7.17 v1(50.8,7.17)
P25-SCL: length 26.5
  Top Layer w0.254: v1(40.89,11.11) 40.89,9.96 U1.38 42.55,8.31 42.55,7.05 40.26,4.76 39.37,4.76 38.35,3.74 38.35,2.09 ; v1(48.51,16.82) 49.15,16.82 R1.1
  Top Layer w0.381: v1(46.74,14.41) U2.6
  Bottom Layer w0.254: v1(40.89,11.11) 44.2,14.41 v1(46.74,14.41) 46.74,15.68 47.88,16.82 v1(48.51,16.82)
P26: length 8.6
  Top Layer w0.254: 40.89,2.09 41.02,2.22 41.02,4.63 43.05,6.66 43.05,8.51 U1.39
P27: length 8.2
  Top Layer w0.254: 43.43,2.09 43.56,2.22 43.56,8.71 U1.40
P32: length 29.7
  Top Layer w0.254: 25.78,21.9 24.51,23.17 21.21,23.17 20.19,24.19 20.19,25.97 ; 25.78,21.9 26.8,20.89 26.8,19.87 28.32,19.87 v1(28.45,19.74) ; 25.78,21.9 28.83,21.9 29.97,20.76 31.5,20.76 36.49,15.77 U1.21 ; v1(29.85,18.35) 29.82,18.35 P32->GND.1
  Bottom Layer w0.254: v1(29.85,18.35) v1(28.45,19.74)
P33: length 24.3
  Top Layer w0.254: v1(23.11,22.54) 22.86,22.79 18.42,22.79 17.65,23.55 17.65,25.97 ; U1.22 31.31,20.25 29.85,20.25 28.83,21.27 v1(28.19,21.27)
  Bottom Layer w0.254: v1(23.11,22.54) 24.38,21.27 v1(28.19,21.27)
P34: length 26.3
  Top Layer w0.254: v1(16.89,22.28) 15.11,24.06 15.11,25.97 ; U1.23 33.77,17.08 v1(33.4,17.08)
  Bottom Layer w0.254: v1(16.89,22.28) 18.03,22.28 19.18,21.14 20.19,21.14 20.95,20.38 28.64,20.38 31.94,17.08 v1(33.4,17.08)
P35: length 33.4
  Top Layer w0.254: v1(34.29,11.49) 35.05,11.49 U1.26 ; 7.62,2.22 7.62,3.87 9.14,5.39 v1(9.14,5.52)
  Bottom Layer w0.254: v1(9.14,5.52) 9.4,5.77 16.76,5.77 17.53,6.54 19.43,6.54 20.32,7.43 23.62,7.43 25.02,8.82 29.85,8.82 30.73,9.71 31.88,9.71 33.66,11.49 v1(34.29,11.49)
P36: length 31
  Top Layer w0.254: 10.16,2.22 10.16,3.87 11.43,5.14 17.02,5.14 17.65,5.77 19.69,5.77 20.57,6.66 v1(23.75,6.66) ; v1(34.42,10.6) 34.86,10.6 U1.27
  Bottom Layer w0.254: v1(23.75,6.66) 25.27,8.19 30.1,8.19 31.11,9.2 32.13,9.2 33.53,10.6 v1(34.42,10.6)
P37: length 28.5
  Top Layer w0.254: 12.7,2.22 12.95,2.47 12.95,3.87 13.59,4.5 17.14,4.5 17.91,5.27 19.69,5.27 20.45,6.03 24,6.03 25.53,7.55 31.37,7.55 33.53,9.71 34.68,9.71 U1.28
P40: length 14.3
  Top Layer w0.254: 27.81,25.97 27.81,24.57 28.45,23.94 29.34,23.94 30.73,22.54 31.85,22.54 U1.18
P41: length 25.9
  Top Layer w0.254: U1.29 35.01,9.33 33.66,9.33 31.5,7.17 25.91,7.17 24.26,5.52 20.83,5.52 19.94,4.63 17.91,4.63 17.27,4 16.13,4 15.49,3.36 15.49,2.09
P42: length 23.8
  Top Layer w0.254: 18.03,2.09 18.03,3.74 18.29,4 20.19,4 21.21,5.01 24.64,5.01 26.16,6.54 31.62,6.54 34.04,8.95 35.33,8.95 U1.30
P43: length 21.3
  Top Layer w0.254: 20.57,2.09 20.57,3.49 21.46,4.38 24.77,4.38 26.29,5.9 31.75,5.9 34.29,8.44 35.53,8.44 U1.31
P44: length 18.9
  Top Layer w0.254: U1.32 35.6,7.81 34.54,7.81 32,5.27 26.54,5.27 25.02,3.74 23.5,3.74 23.11,3.36 23.11,2.09
P45: length 9.3
  Top Layer w0.254: 45.97,2.09 45.97,4.76 44.07,6.66 44.07,8.91 U1.41
P46: length 10.6
  Top Layer w0.254: U1.42 44.58,9.1 44.58,7.05 48.51,3.11 48.51,2.09
P47: length 11.2
  Top Layer w0.254: U1.7 45.08,18.7 45.08,20.89 48.13,23.94 48.13,25.97
P50: length 28.9
  Top Layer w0.254: v1(33.91,15.17) 34.97,15.17 U1.24 ; 12.32,25.97 12.32,24.06 v1(12.83,23.55)
  Bottom Layer w0.254: v1(12.83,23.55) 14.35,23.55 16.76,21.14 18.42,21.14 18.92,20.63 19.94,20.63 20.95,19.62 23.37,19.62 23.88,19.11 27.94,19.11 31.88,15.17 v1(33.91,15.17)
P51: length 32.6
  Top Layer w0.254: v1(11.18,23.81) 10.29,23.81 9.78,24.32 9.78,25.97 ; v1(34.16,12.25) 34.29,12.12 34.97,12.12 U1.25
  Bottom Layer w0.254: v1(11.18,23.81) 12.19,22.79 13.97,22.79 16.13,20.63 18.16,20.63 18.67,20.13 19.94,20.13 20.83,19.24 22.92,19.24 23.69,18.47 27.94,18.47 v1(34.16,12.25)
P52: length 24.4
  Top Layer w0.254: 63.75,2.09 63.75,3.74 62.61,4.89 54.74,4.89 53.72,5.9 50.93,5.9 47.88,8.95 47.88,10.05 U1.48
P53: length 40.7
  Top Layer w0.254: 63.37,24.06 62.86,23.55 61.47,23.55 60.2,22.28 55.25,22.28 53.47,20.51 49.91,20.51 48.77,19.36 48.77,18.14 U1.1 ; 63.37,24.06 64.01,23.43 64.26,23.43 65.41,22.28 65.41,10.73 64.84,10.17 R7.1 ; 63.37,24.06 63.37,25.97
P54-RST: length 10.7
  Top Layer w0.254: 32.89,25.97 32.89,23.55 36.45,20 37.22,20 38.97,18.24
USB_D+: length 7
  Top Layer w0.254: 9.59,14.41 8.58,13.39 6.47,13.39 ; 9.59,14.41 6.48,14.41 ; 9.59,14.41 SW3.2
USB_D-: length 21.3
  Top Layer w0.254: 14.48,14.66 SW3.5 ; 14.48,14.66 13.85,14.03 v1(12.83,14.03) ; 14.48,14.66 13.84,14.66 12.7,15.81 8.51,15.81 7.59,14.89 6.46,14.89 ; v1(5.08,14.03) 5.21,13.91 6.73,13.91
  Bottom Layer w0.254: v1(5.08,14.03) v1(12.83,14.03)
VREF: length 45.2
  Top Layer w0.254: v1(36.96,19.36) 36.95,19.35 36.95,18.86
  Top Layer w0.381: U1.16 36.95,18.86
  Top Layer w0.508: 30.35,25.97 30.35,24.19 31.37,23.17 32.26,23.17 36.2,19.24 36.57,19.24 36.95,18.86 ; U3.2 63.03,19.62 62.36,19.62 61.79,20.18 R3.1 60.31,21.41 60.07,21.65 55.5,21.65 v1(53.72,19.87)
  Top Layer w0.635: U3.2 U3.1
  Bottom Layer w0.508: v1(36.96,19.36) 37.21,19.11 42.55,19.11 43.31,19.87 v1(53.72,19.87)
$1N661: length 11.4
  Top Layer w0.254: U1.13 38.61,19.32 v1(38.61,19.87) ; v1(33.15,15.94) 32.24,15.94 C1.1
  Bottom Layer w0.254: v1(38.61,19.87) 37.85,20.63 36.32,20.63 35.05,19.36 35.05,17.84 v1(33.15,15.94)
$1N2230: length 7.3
  Top Layer w0.254: R4.1 9.78,7.08 9.78,9.2 9.27,9.71 9.27,10.75 7.64,12.38 6.76,12.38
$1N2337: length 7.4
  Top Layer w0.254: R5.2 8.57,20.87 8.57,16.63 7.33,15.39 6.46,15.39
$1N3155: length 10.7
  Top Layer w0.254: D2.1 21.23,16.82 21.72,16.82 22.35,16.19 22.35,14.03 23.88,12.51 23.88,9.97 24.26,9.58 U4.6
$1N3377: length 3.6
  Top Layer w0.254: R6.2 61.8,7.11 POWER.2
$1N3427: length 12.4
  Top Layer w0.254: P35-LED.2 58.33,20.25 59.44,20.25 59.94,19.74 59.94,12.02 R7.2
$1N4416: length 16.6
  Top Layer w0.254: SW3.3 12.49,17.16 v1(13.72,15.94) ; R8.1 18.1,7.43 v1(14.99,7.43)
  Bottom Layer w0.254: v1(13.72,15.94) 13.72,8.7 v1(14.99,7.43)
$1N4419: length 3.4
  Top Layer w0.254: SW3.6 17.69,15.03 R9.1

## Copper pours and planes (outline as drawn; the poured copper is in the pictures)
GND on Top Layer: -0.25,28.13 66.04,28.13 66.04,0.06 -0.25,0.06
GND on Bottom Layer: -0.13,28.13 66.17,28.13 66.17,-0.19 -0.13,-0.19

Small or netless copper shapes (teardrops, artwork), in the pictures only: 209 on Top Layer, 42 on Bottom Layer

## Text on the board
Top Silkscreen Layer: REST | GND | +5V | P35 | P36 | P41 | P42 | P43 | P44 | P20 | P21 | P22 | P23 | P24 | P25 | honestliu.com | P26 | P27 | P45 | P46 | P00 | P01 | P02 | P03 | P04 | P52 | 3V3 | P51 | P50 | P34 | P33 | P32 | P31 | P30 | P40 | VREF | P54 | P13 | P17 | P16 | P15 | P14 | P47 | P11 | P10 | P07 | P06 | P05 | P53 | P37 | HID | STC8H8K64U | 串口 | 誠君
